# Altium schematic sheet mahirAMPLIFER.SchDoc
size A; SheetNumber: 4; SheetTotal: 4
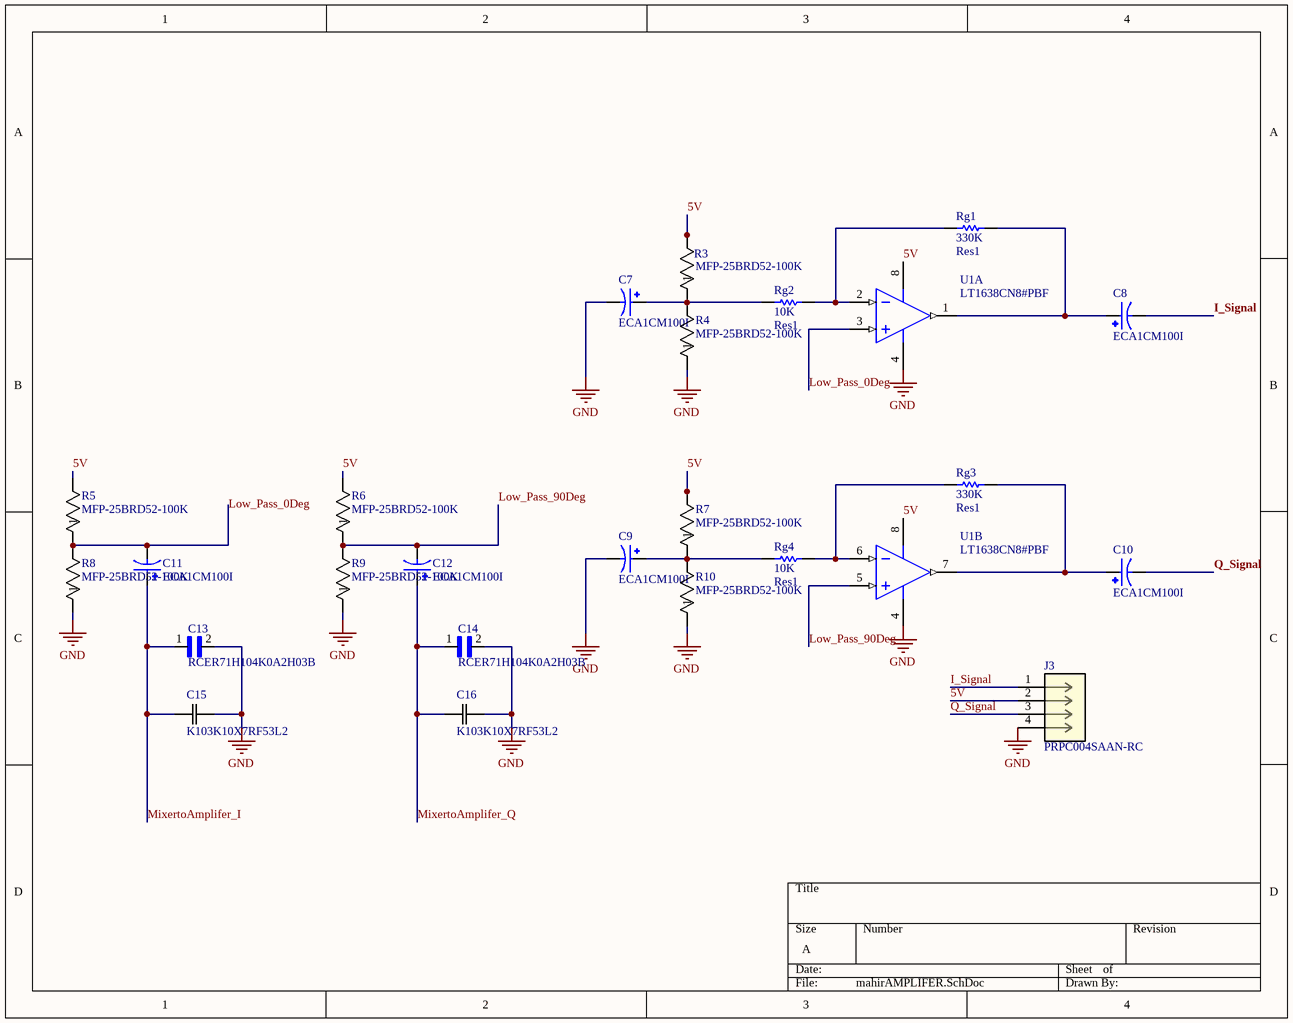
[diagram p0: mahirAMPLIFER.SchDoc]

## Parts
C7  ECA1CM100I  [CAPPRD250W50D500H1100]
C8  ECA1CM100I  [CAPPRD250W50D500H1100]
C9  ECA1CM100I  [CAPPRD250W50D500H1100]
C10  ECA1CM100I  [CAPPRD250W50D500H1100]
C11  ECA1CM100I  [CAPPRD250W50D500H1100]
C12  ECA1CM100I  [CAPPRD250W50D500H1100]
C13  RCER71H104K0A2H03B  [CAP_RCER71H104K0A2H03B]
C14  RCER71H104K0A2H03B  [CAP_RCER71H104K0A2H03B]
C15  K103K10X7RF53L2  [K103K10X7RF53L2_VIS]
C16  K103K10X7RF53L2  [K103K10X7RF53L2_VIS]
J3  PRPC004SAAN-RC  [CONN4_PRPC004_SUL]
R3  MFP-25BRD52-100K  [YAG_MF25_YAG]
R4  MFP-25BRD52-100K  [YAG_MF25_YAG]
R5  MFP-25BRD52-100K  [YAG_MF25_YAG]
R6  MFP-25BRD52-100K  [YAG_MF25_YAG]
R7  MFP-25BRD52-100K  [YAG_MF25_YAG]
R8  MFP-25BRD52-100K  [YAG_MF25_YAG]
R9  MFP-25BRD52-100K  [YAG_MF25_YAG]
R10  MFP-25BRD52-100K  [YAG_MF25_YAG]
Rg1  Res1  value 330K  [AXIAL-0.1-RES]
Rg2  Res1  value 10K  [AXIAL-0.1-RES]
Rg3  Res1  value 330K  [AXIAL-0.1-RES]
Rg4  Res1  value 10K  [AXIAL-0.1-RES]
U1  LT1638CN8#PBF  [LT-N8-8]  (parts A,B of 2)

## Nets
GND: C7.N C9.N C13.2 C14.2 C15.2 C16.2 J3.4 R4.1 R8.1 R9.1 R10.1 U1.4(V-)
5V: J3.2 R3.2 R5.2 R6.2 R7.2 U1.8(V+)
I_Signal: C8.N J3.1
Low_Pass_0Deg: C11.N R5.1 R8.2 U1.3(+IN_A)
Low_Pass_90Deg: C12.N R6.1 R9.2 U1.5(+IN_B)
MixertoAmplifer_I: C11.P C13.1 C15.1
MixertoAmplifer_Q: C12.P C14.1 C16.1
Q_Signal: C10.N J3.3
NetC7_P: C7.P R3.1 R4.2 Rg2.1
NetC8_P: C8.P Rg1.2 U1.1(OUT_A)
NetC9_P: C9.P R7.1 R10.2 Rg4.1
NetC10_P: C10.P Rg3.2 U1.7(OUT_B)
NetRg1_1: Rg1.1 Rg2.2 U1.2(-IN_A)
NetRg3_1: Rg3.1 Rg4.2 U1.6(-IN_B)

## Library data of the parts
C7-C12 = ECA1CM100I: 10ÂµF 16V Aluminum Electrolytic Capacitors Radial, Can 2000 Hrs @ 85Â°C; MF: Panasonic; SnapEDA_Link: https://www.snapeda.com/parts/ECA1CM100I/Panasonic/view-part/?ref=snap; Check_prices: https://www.snapeda.com/parts/ECA1CM100I/Panasonic/view-part/?ref=eda; MP: ECA1CM100I; Digi-Key_Part_Number: P19513TB-ND; Package: RADIAL-2 Panasonic; Value: *
C13 C14 = RCER71H104K0A2H03B: Cap Ceramic 1pF 50V C0G 0.25pF Radial 2.5mm 125C Automotive Bulk; Package: None; Price: None; Value: *; MP: RCER71H104K0A2H03B; Availability: Unavailable
C15 C16 = K103K10X7RF53L2: No Description Available; Mfr_Name: Vishay; Type: Ceramic Capacitor
J3 = PRPC004SAAN-RC: No Description Available; Mfr_Name: Sullins; Type: Headers, Male Pins; RefDes: RefDes
R3-R10 = MFP-25BRD52-100K: No Description Available; Mfr_Name: Yageo
Rg1 Rg3 = RES 330K OHM 5% 1/4W AXIAL: Resistor; Manufacturer Part Number: CFR-25JB-52-330K; Designator: R?; Power Rating: 1/4W; Tolerance: 0.05; Published: 8-Jun-2000; LatestRevisionDate: 17-Jul-2002; LatestRevisionNote: Re-released for DXP Platform.; Publisher: Altium Limited
Rg2 Rg4 = RES 10K OHM 5% 1/4W AXIAL: Resistor; Manufacturer Part Number: CFR-25JB-52-10K; Designator: R?; Power Rating: 1/4W; Tolerance: 0.05; Published: 8-Jun-2000; LatestRevisionDate: 17-Jul-2002; LatestRevisionNote: Re-released for DXP Platform.; Publisher: Altium Limited
U1 = CMP-0359-01111-2: Dual Channel, High Voltage, Micropower Rail-to-Rail Operational Amplifier, 1.2 MHz Typical GBW, 0.38 V/us Typical SR, 2.2 to 44 V, 8-Pin DIP (N8-8), Commercial, Pb-Free; Manufacturer: Linear Technology; Linear Technology Part Number: LT1638; Vos (mV) Typical: 0.2; Vos (mV) Guaranteed: 0.6; Vs Max (V): 44; Vs Min (V): 2.2; SR (V/us) Typical: 0.38; Channels (#): 2; GBW (MHz) Typical: 1.2; Is (mA) Typical: 0.17; PackageVersion: Rev I; ComponentLink3URL: http://cds.linear.com/docs/en/packaging/05081510_I_N8.pdf; PackageDescription: 8-Lead PDIP, Body 10.16 x 6.48 mm, Pitch 2.54 mm; Mounting Technology: Surface Mount; ComponentLink2URL: http://cds.linear.com/docs/en/datasheet/16389fg.pdf; ComponentLink1URL: http://www.linear.com/; ComponentLink3Description: Package Specification; RevisionNote: URLs updated; PackageReference: LT-N8-8; PartNumber: LT1638CN8#PBF; DatasheetVersion: Rev. G; ComponentLink1Description: Manufacturer URL; ComponentLink2Description: Datasheet; Type: VFB; RoHS: Pb-Free